# EAGLE design Flight Controller (EAGLE 9.6.2)
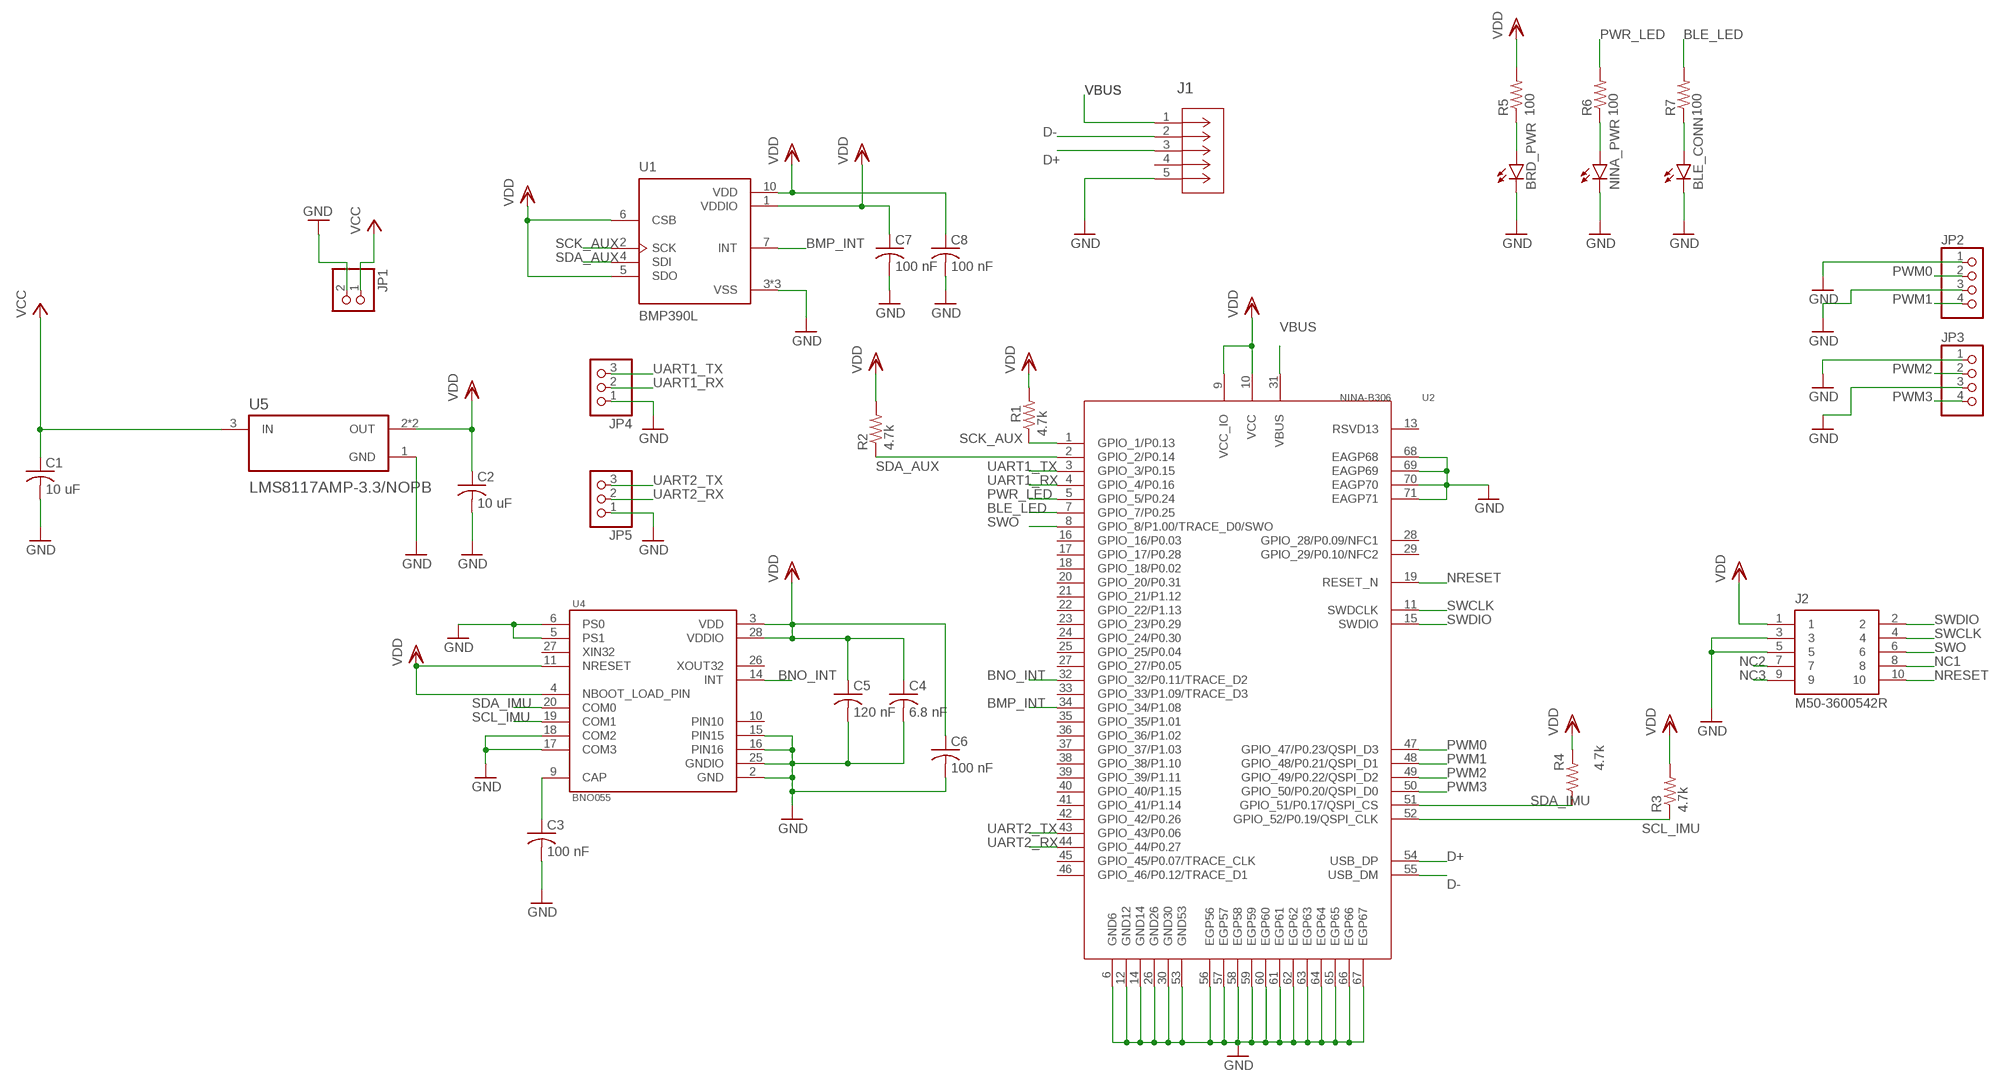
[diagram p0: schematic, sheet 1]

## Parts
BLE_CONN  LEDCHIPLED_1206  [CHIPLED_1206]
BRD_PWR  LEDCHIPLED_1206  [CHIPLED_1206]
C1  10 uF  C-USC1206  [C1206]
C2  10 uF  C-USC1206  [C1206]
C3  100 nF  C-USC1206  [C1206]
C4  6.8 nF  C-USC1206  [C1206]
C5  120 nF  C-USC1206  [C1206]
C6  100 nF  C-USC1206  [C1206]
C7  100 nF  C-USC1206  [C1206]
C8  100 nF  C-USC1206  [C1206]
J1  ZX62-AB-5PA(31)  [CONN5_ZX62-AB-5PA_HIR]
J2  M50-3600542R  [HARWIN_M50-3600542R]
JP1  PINHD-1X2  [1X02]
JP2  PINHD-1X4  [1X04]
JP3  PINHD-1X4  [1X04]
JP4  PINHD-1X3  [1X03]
JP5  PINHD-1X3  [1X03]
NINA_PWR  LEDCHIPLED_1206  [CHIPLED_1206]
R1  4.7k  R-US_R1206  [R1206]
R2  4.7k  R-US_R1206  [R1206]
R3  4.7k  R-US_R1206  [R1206]
R4  4.7k  R-US_R1206  [R1206]
R5  100  R-US_R1206  [R1206]
R6  100  R-US_R1206  [R1206]
R7  100  R-US_R1206  [R1206]
U1  BMP390L  [XDCR_BMP390L]
U2  NINA-B306  NINA-B306NINA-B306_NINA_LGA71R_1500X1000X223_PCB  [NINA_LGA71R_1500X1000X223_PCB]
U4  BNO055  [LGA28R50P4X10_380X520X100]
U5  LMS8117AMP-3.3/NOPB  [SOT230P700X180-4N]

## Nets
BLE_LED: R7.2 U2.7(GPIO_7/P0.25)
BMP_INT: U1.7(INT) U2.34(GPIO_34/P1.08)
BNO_INT: U2.32(GPIO_32/P0.11/TRACE_D2) U4.14(INT)
D+: J1.3(D+) U2.54(USB_DP)
D-: J1.2(D-) U2.55(USB_DM)
GND: BLE_CONN.C BRD_PWR.C C1.2 C2.2 C3.2 C4.2 C5.2 C6.2 C7.2 C8.2 J1.5(GND) J2.3 J2.5 JP1.2 JP2.1 JP2.3 JP3.1 JP3.3 JP4.1 JP5.1 NINA_PWR.C U1.3(VSS) U1.8(VSS) U1.9(VSS) U2.6(GND6) U2.12(GND12) U2.14(GND14) U2.26(GND26) U2.30(GND30) U2.53(GND53) U2.56(EGP56) U2.57(EGP57) U2.58(EGP58) U2.59(EGP59) U2.60(EGP60) U2.61(EGP61) U2.62(EGP62) U2.63(EGP63) U2.64(EGP64) U2.65(EGP65) U2.66(EGP66) U2.67(EGP67) U2.68(EAGP68) U2.69(EAGP69) U2.70(EAGP70) U2.71(EAGP71) U4.2(GND) U4.5(PS1) U4.6(PS0) U4.15(PIN15) U4.16(PIN16) U4.17(COM3) U4.18(COM2) U4.25(GNDIO) U5.1(GND)
N$1: BRD_PWR.A R5.1
N$2: NINA_PWR.A R6.1
N$3: BLE_CONN.A R7.1
N$4: C3.1 U4.9(CAP)
NC1: J2.8
NC2: J2.7
NC3: J2.9
NRESET: J2.10 U2.19(RESET_N)
PWM0: JP2.2 U2.47(GPIO_47/P0.23/QSPI_D3)
PWM1: JP2.4 U2.48(GPIO_48/P0.21/QSPI_D1)
PWM2: JP3.2 U2.49(GPIO_49/P0.22/QSPI_D2)
PWM3: JP3.4 U2.50(GPIO_50/P0.20/QSPI_D0)
PWR_LED: R6.2 U2.5(GPIO_5/P0.24)
SCK_AUX: R1.1 U1.2(SCK) U2.1(GPIO_1/P0.13)
SCL_IMU: R3.1 U2.52(GPIO_52/P0.19/QSPI_CLK) U4.19(COM1)
SDA_AUX: R2.1 U1.4(SDI) U2.2(GPIO_2/P0.14)
SDA_IMU: R4.1 U2.51(GPIO_51/P0.17/QSPI_CS) U4.20(COM0)
SWCLK: J2.4 U2.11(SWDCLK)
SWDIO: J2.2 U2.15(SWDIO)
SWO: J2.6 U2.8(GPIO_8/P1.00/TRACE_D0/SWO)
UART1_RX: JP4.2 U2.4(GPIO_4/P0.16)
UART1_TX: JP4.3 U2.3(GPIO_3/P0.15)
UART2_RX: JP5.2 U2.44(GPIO_44/P0.27)
UART2_TX: JP5.3 U2.43(GPIO_43/P0.06)
VBUS: J1.1(VCC) U2.31(VBUS)
VCC: C1.1 JP1.1 U5.3(IN)
VDD: C2.1 C4.1 C5.1 C6.1 C7.1 C8.1 J2.1 R1.2 R2.2 R3.2 R4.2 R5.2 U1.1(VDDIO) U1.5(SDO) U1.6(CSB) U1.10(VDD) U2.9(VCC_IO) U2.10(VCC) U4.3(VDD) U4.4(NBOOT_LOAD_PIN) U4.11(NRESET) U4.28(VDDIO) U5.2(OUT) U5.4(OUT)
Unconnected: J1.4(ID) U2.13(RSVD13) U2.16(GPIO_16/P0.03) U2.17(GPIO_17/P0.28) U2.18(GPIO_18/P0.02) U2.20(GPIO_20/P0.31) U2.21(GPIO_21/P1.12) U2.22(GPIO_22/P1.13) U2.23(GPIO_23/P0.29) U2.24(GPIO_24/P0.30) U2.25(GPIO_25/P0.04) U2.27(GPIO_27/P0.05) U2.28(GPIO_28/P0.09/NFC1) U2.29(GPIO_29/P0.10/NFC2) U2.33(GPIO_33/P1.09/TRACE_D3) U2.35(GPIO_35/P1.01) U2.36(GPIO_36/P1.02) U2.37(GPIO_37/P1.03) U2.38(GPIO_38/P1.10) U2.39(GPIO_39/P1.11) U2.40(GPIO_40/P1.15) U2.41(GPIO_41/P1.14) U2.42(GPIO_42/P0.26) U2.45(GPIO_45/P0.07/TRACE_CLK) U2.46(GPIO_46/P0.12/TRACE_D1) U4.26(XOUT32) U4.27(XIN32)

## Power pins joined to a net without a drawn wire
PIN10: U4.10(PIN10)

## Library data of the parts
BLE_CONN BRD_PWR NINA_PWR = led:LED: LED OSRAM: - CHIPLED LG R971, LG N971, LY N971, LG Q971, LY Q971, LO R971, LY R971 LH N974, LH R974 LS Q976, LO Q976, LY Q976 LO Q996 - Hyper CHIPLED LW Q18S LB Q993, LB Q99A, LB R99A - SideLED LS A670, LO A670, LY A670, LG A670, LP A670 LB A673, LV A673, LT A673, LW A673 LH A674 LY A675 LS A676, LA A676, LO A676, LY A676, LW A676 LS A679, LY A679, LG A679 - Hyper Micro SIDELED® LS Y876, LA Y876, LO Y876, LY Y876 LT Y87S - SmartLED LW L88C, LW L88S LB L89C, LB L89S, LG L890 LS L89K, LO L89K, LY L89K LS L896, LA L896, LO L896, LY L896 - TOPLED LS T670, LO T670, LY T670, LG T670, LP T670 LSG T670, LSP T670, LSY T670, LOP T670, LYG T670 LG T671, LOG T671, LSG T671 LB T673, LV T673, LT T673, LW T673 LH T674 LS T676, LA T676, LO T676, LY T676, LB T676, LH T676, LSB T676, LW T676 LB T67C, LV T67C, LT T67C, LS T67K, LO T67K, LY T67K, LW E67C LS E67B, LA E67B, LO E67B, LY E67B, LB E67C, LV E67C, LT E67C LW T67C LS T679, LY T679, LG T679 LS T770, LO T770, LY T770, LG T770, LP T770 LB T773, LV T773, LT T773, LW T773 LH T774 LS E675, LA E675, LY E675, LS T675 LS T776, LA T776, LO T776, LY T776, LB T776 LHGB T686 LT T68C, LB T68C - Hyper Mini TOPLED® LB M676 - Mini TOPLED Santana® LG M470 LS M47K, LO M47K, LY M47K Source: http://www.osram.convergy.de LUXEON: - LUMILED® LXK2-PW12-R00, LXK2-PW12-S00, LXK2-PW14-U00, LXK2-PW14-V00 LXK2-PM12-R00, LXK2-PM12-S00, LXK2-PM14-U00 LXK2-PE12-Q00, LXK2-PE12-R00, LXK2-PE12-S00, LXK2-PE14-T00, LXK2-PE14-U00 LXK2-PB12-K00, LXK2-PB12-L00, LXK2-PB12-M00, LXK2-PB14-N00, LXK2-PB14-P00, LXK2-PB14-Q00 LXK2-PR12-L00, LXK2-PR12-M00, LXK2-PR14-Q00, LXK2-PR14-R00 LXK2-PD12-Q00, LXK2-PD12-R00, LXK2-PD12-S00 LXK2-PH12-R00, LXK2-PH12-S00 LXK2-PL12-P00, LXK2-PL12-Q00, LXK2-PL12-R00 Source: www.luxeon.com KINGBRIGHT: KA-3528ASYC Source: www.kingbright.com
C1-C8 = rcl:C-US: CAPACITOR, American symbol; SPICEPREFIX: C
J1 = USBHousing:ZX62-AB-5PA(31); COPYRIGHT: Copyright (C) 2022 Ultra Librarian. All rights reserved.; DIGI-KEY_PART_NUMBER_1: H125279CT-ND; DIGI-KEY_PART_NUMBER_2: H125279DKR-ND; DIGI-KEY_PART_NUMBER_3: H125279TR-ND; MANUFACTURER_PART_NUMBER: ZX62-AB-5PA(31); MFR_NAME: Hirose
J2 = M50-3600542R:M50-3600542R: Connector Header Surface Mount 10 position 0.050 Inch (1.27mm) Check availability <https://pricing.snapeda.com/parts/M50-3600542R/Harwin%20Inc./view-part?ref=eda>; AVAILABILITY: In Stock; DESCRIPTION: Connector Header Surface Mount 10 position 0.050 (1.27mm); MF: Harwin Inc.; MP: M50-3600542R; PACKAGE: None; PRICE: None; PURCHASE-URL: https://pricing.snapeda.com/search/part/M50-3600542R/?ref=eda
JP1 = pinhead:PINHD-1X2: PIN HEADER
JP2 JP3 = pinhead:PINHD-1X4: PIN HEADER
JP4 JP5 = pinhead:PINHD-1X3: PIN HEADER
R1-R7 = rcl:R-US_: RESISTOR, American symbol; SPICEPREFIX: R
U1 = BMP390L:BMP390L: Check availability <https://pricing.snapeda.com/parts/BMP390L/Bosch%20Sensortec/view-part?ref=eda>; AVAILABILITY: In Stock; DESCRIPTION: Pressure Sensor 4.35PSI ~ 18.13PSI (30kPa ~ 125kPa) Absolute - - 10-WFLGA; MF: Bosch Sensortec; MP: BMP390L; PACKAGE: None; PRICE: None; PURCHASE-URL: https://pricing.snapeda.com/search/part/BMP390L/?ref=eda
U2 = ubloxLib:NINA-B306: u-blox NINA-B306 Bluetooth 5 LE, 802.15.4 module; MANUFACTURER: u-blox; PART_DESCRIPTION: Stand-alone Bluetooth low energy module
U4 = BNO055:BNO055: BNO055 9-axis Absolute Orientation Sensor ( SiP ) w/Sensors and Sensor Fusion Check availability <https://pricing.snapeda.com/parts/BNO055/Bosch/view-part?ref=eda>; AVAILABILITY: In Stock; DESCRIPTION: BNO055 series Accelerometer, Gyroscope, Magnetometer, 3 Axis Sensor Evaluation Board; MF: Bosch; MP: BNO055; PACKAGE: LGA-28 Bosch; PRICE: None; PURCHASE-URL: https://pricing.snapeda.com/search/part/BNO055/?ref=eda
U5 = LMS8117AMP-3.3_NOPB:LMS8117AMP-3.3/NOPB: Check availability <https://pricing.snapeda.com/parts/LMS8117AMP-3.3/NOPB/Texas%20Instruments/view-part?ref=eda>; AVAILABILITY: In Stock; DESCRIPTION: 1-A, 15-V, linear voltage regulator from 0°C to 125°C; MF: Texas Instruments; MP: LMS8117AMP-3.3/NOPB; PACKAGE: SOT-223-4 Texas Instruments; PRICE: None; PURCHASE-URL: https://pricing.snapeda.com/search/part/LMS8117AMP-3.3/NOPB/?ref=eda

## Board
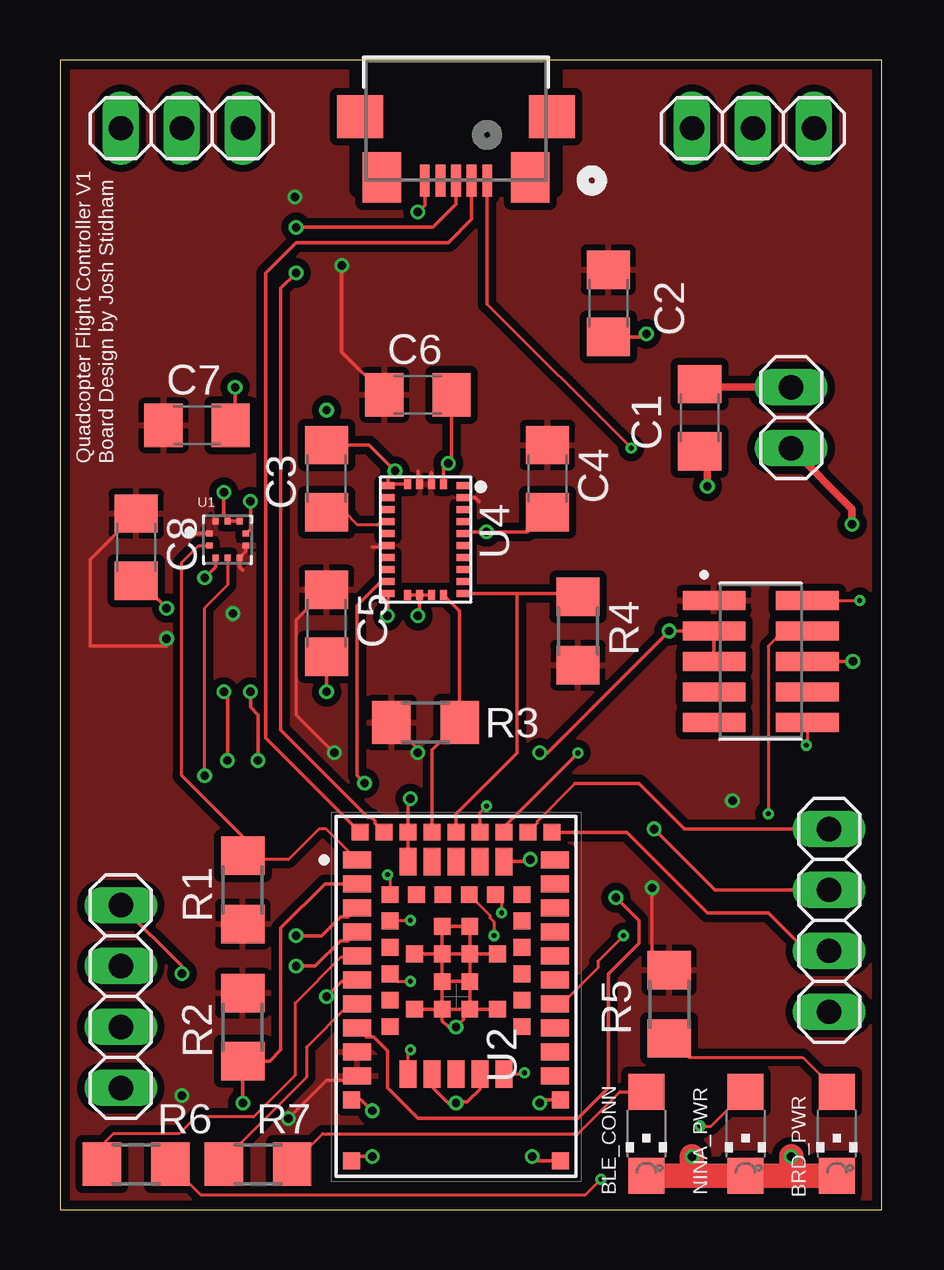
[diagram p1: board, top side]
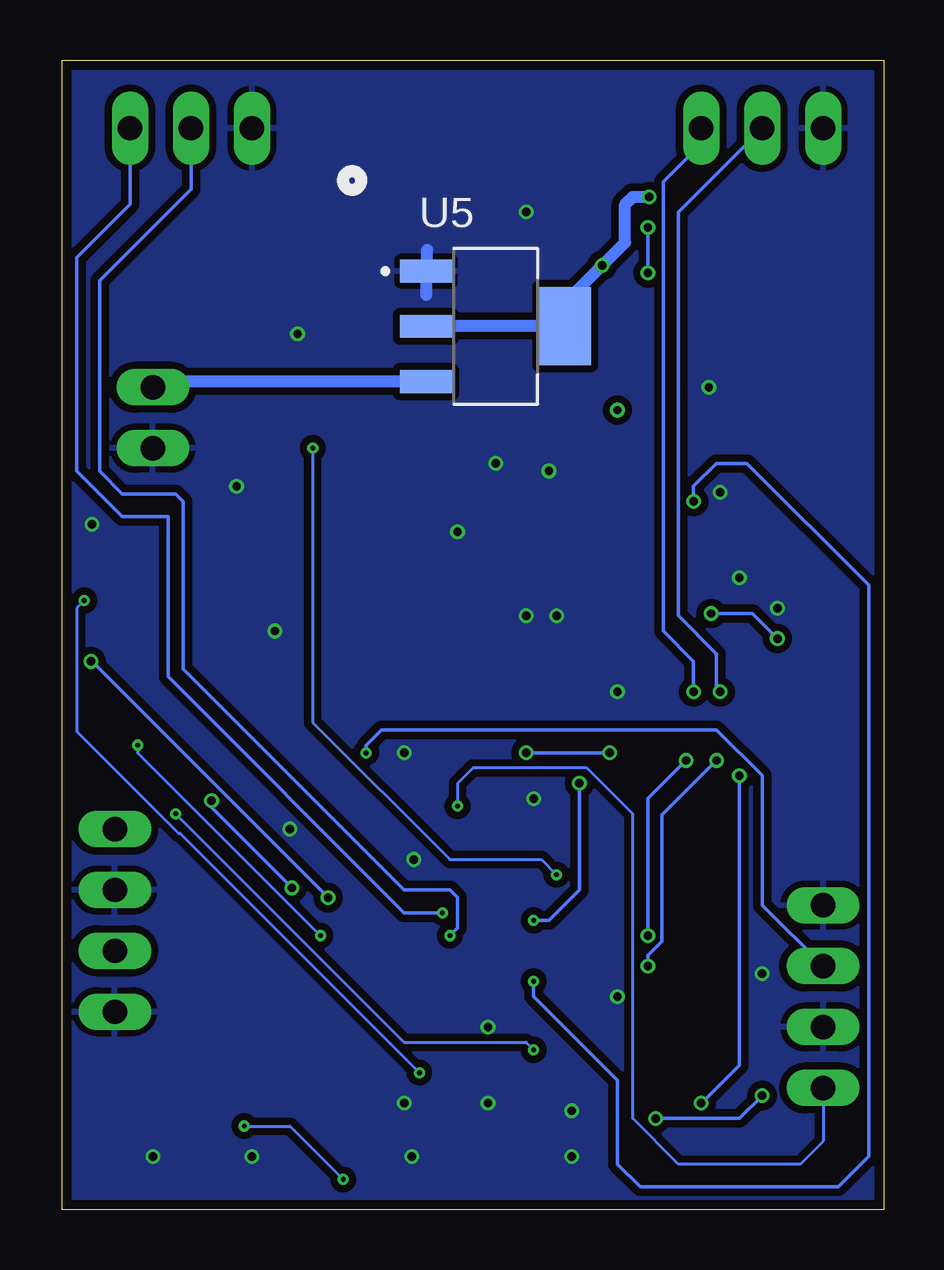
[diagram p2: board, bottom side, seen from below]

Size 34.27 x 47.93 mm. Coordinates in mm from the lower left corner, seen from the top.
Outline: 0,0 34.27,0 34.27,47.93 0,47.93 0,0
Copper layers (1*16): Top 0.035mm / dielectric 1.5mm / Bottom 0.035mm
Design rules "default *": minimum track width 5mil, minimum drill 0.2mm, track to track 5mil, track to pad 0.2mm, pad to pad 5mil, via to via 0.5mm, smd to smd 5mil, copper to edge 0.4mm, drill to drill 0.5mm, minimum pad ring 0.13mm, minimum via ring 0.13mm, stop-mask expansion 4mil, vias tented up to drill 0mil, thermal gap 10mil

### Footprints (pad centres in the part's own frame; a part is rotated, then mirrored left to right if it is on the bottom)
CHIPLED_1206 = smd 1.5 x 1.5: A 0,-1.75; C 0,1.75
C1206 = smd 1.6 x 1.8: 1 -1.4,0; 2 1.4,0
CONN5_ZX62-AB-5PA_HIR = smd 0.406 x 1.346: 1 -1.3,2.502; 2 -0.65,2.502; 3 0,2.502; 4 0.65,2.502; 5 1.3,2.502 | smd 1.6 x 2.108: 6 -3.099,2.375; 7 3.099,2.375 | smd 1.905 x 1.803: 8 -4,-0.165; 9 4,-0.165
HARWIN_M50-3600542R = smd 0.8 x 2.62: 1 -2.54,-1.94; 2 -2.54,1.94; 3 -1.27,-1.94; 4 -1.27,1.94; 5 0,-1.94; 6 0,1.94; 7 1.27,-1.94; 8 1.27,1.94; 9 2.54,-1.94; 10 2.54,1.94
1X02 = drill 1.016 long: 1 -1.27,0; 2 1.27,0
1X04 = drill 1.016 long: 1 -3.81,0; 2 -1.27,0; 3 1.27,0; 4 3.81,0
1X03 = drill 1.016 long: 1 -2.54,0; 2 0,0; 3 2.54,0
R1206 = smd 1.6 x 1.803: 1 -1.422,0; 2 1.422,0
XDCR_BMP390L = smd 0.275 x 0.25: 1 -0.762,0.25; 2 -0.762,-0.25; 6 0.762,-0.25; 7 0.762,0.25 | smd 0.25 x 0.275: 3 -0.5,-0.762; 4 0,-0.762; 5 0.5,-0.762; 8 0.5,0.762; 9 0,0.762; 10 -0.5,0.762
NINA_LGA71R_1500X1000X223_PCB = smd 0.7 x 1.15: 1 -5.7,-4.125; 2 -4.7,-4.125; 3 -3.7,-4.125; 4 -2.7,-4.125; 5 -1.7,-4.125; 6 -0.7,-4.125; 7 0.3,-4.125; 8 1.3,-4.125; 9 2.3,-4.125; 10 3.3,-4.125; 16 3.3,4.125; 17 2.3,4.125; 18 1.3,4.125; 19 0.3,4.125; 20 -0.7,4.125; 21 -1.7,4.125; 22 -2.7,4.125; 23 -3.7,4.125; 24 -4.7,4.125; 25 -5.7,4.125 | smd 1.15 x 0.7: 11 3.225,-2; 12 3.225,-1; 13 3.225,0; 14 3.225,1; 15 3.225,2; 26 -5.625,2; 27 -5.625,1; 28 -5.625,0; 29 -5.625,-1; 30 -5.625,-2 | smd 0.7 x 0.7: 31 -4.25,-2.75; 32 -3.15,-2.75; 33 -2.05,-2.75; 34 -0.95,-2.75; 35 0.15,-2.75; 36 1.25,-2.75; 37 1.25,2.75; 38 0.15,2.75; 39 -0.95,2.75; 40 -2.05,2.75; 41 -3.15,2.75; 42 -4.25,2.75; 43 -4.25,1.65; 44 -4.25,0.55; 45 -4.25,-0.55; 46 -4.25,-1.65; 47 -6.85,4; 48 -6.85,3; 49 -6.85,2; 50 -6.85,1; 51 -6.85,0; 52 -6.85,-1; 53 -6.85,-2; 54 -6.85,-3; 55 -6.85,-4; 56 -2.925,-0.575; 57 -2.925,0.575; 58 -1.775,-1.725; 59 -1.775,-0.575; 60 -1.775,0.575; 61 -1.775,1.725; 62 -0.625,-0.575; 63 -0.625,0.575; 64 0.525,-1.725; 65 0.525,-0.575; 66 0.525,0.575; 67 0.525,1.725; 68 4.3,-4.35; 69 6.85,-4.35; 70 6.85,4.35; 71 4.3,4.35
LGA28R50P4X10_380X520X100 = smd 0.3 x 0.525: 1 -2.25,1.562; 6 -2.25,-1.562; 7 -1.75,-1.562; 8 -1.25,-1.562; 9 -0.75,-1.562; 10 -0.25,-1.562; 11 0.25,-1.562; 12 0.75,-1.562; 13 1.25,-1.562; 14 1.75,-1.562; 15 2.25,-1.562; 20 2.25,1.562; 21 1.75,1.562; 22 1.25,1.562; 23 0.75,1.562; 24 0.25,1.562; 25 -0.25,1.562; 26 -0.75,1.562; 27 -1.25,1.562; 28 -1.75,1.562 | smd 0.425 x 0.3: 2 -2.312,0.75; 3 -2.312,0.25; 4 -2.312,-0.25; 5 -2.312,-0.75; 16 2.312,-0.75; 17 2.312,-0.25; 18 2.312,0.25; 19 2.312,0.75
SOT230P700X180-4N = smd 2.15 x 0.95: 1 -2.9,2.3; 2 -2.9,0; 3 -2.9,-2.3 | smd 2.15 x 3.25: 4 2.9,0

### Placement (x,y rotation side)
BLE_CONN  24.45,3.17 180 top
BRD_PWR  32.38,3.17 180 top
C1  26.67,33.02 270 top
C2  22.86,37.78 270 top
C3  11.11,30.48 90 top
C4  20.32,30.48 270 top
C5  11.11,24.45 270 top
C6  14.92,33.97 0 top
C7  5.71,32.7 0 top
C8  3.17,27.62 270 top
J1  16.51,45.4 180 top
J2  29.21,22.86 270 top
JP1  30.48,33.02 270 top
JP2  32.07,12.06 90 top
JP3  2.54,8.89 270 top
JP4  5.08,45.09 0 top
JP5  28.89,45.09 0 top
NINA_PWR  28.57,3.17 180 top
R1  7.62,13.34 270 top
R2  7.62,7.62 90 top
R3  15.24,20.32 180 top
R4  21.59,24.13 270 top
R5  25.4,8.57 90 top
R6  3.17,1.91 180 top
R7  8.26,1.91 180 top
U1  6.99,27.94 0 top
U2  16.51,8.89 270 top
U4  15.24,27.94 270 top
U5  16.19,36.83 0 bottom

### Tracks (layer width: path | path; a pad name or v marks a point on that pad's centre or on a via)
BLE_LED
  Top 0.127: U2.7 12.32,8.52 12.02,8.52 10.28,6.78 10.28,5.51 6.83,2.07 R7.2
BMP_INT  (via drill 0.2, 0.35)
  Top 0.127: U2.34 14.07,9.53 v14.61,9.53
  Top 0.152: v7.94,29.53 7.94,28.38 U1.7
  Bottom 0.152: v14.61,9.53 14.61,8.89 11.11,5.4 11.11,1.91 10.16,0.95 1.91,0.95 0.64,2.22 0.64,26.04 5.71,31.11 6.99,31.11 7.94,30.16 v7.94,29.53
BNO_INT  (via drill 0.2, 0.35)
  Top 0.127: v14.61,12.06 14.58,12.04 U2.32
  Top 0.152: U4.14 13.6,26.12 13.3,26.12 12.38,25.2 12.38,18.1 v12.7,17.78
  Bottom 0.152: v12.7,17.78 12.7,13.34 13.97,12.06 v14.61,12.06
D+  (via drill 0.35)
  Top 0.152: v9.84,40.96 15.56,40.96 16.51,41.91 J1.3 | U2.54 13.14,16.11 13.14,16.2 12.97,16.37 12.84,16.37 9.21,20 9.21,38.42 v9.84,39.05
  Bottom 0.152: v9.84,40.96 v9.84,39.05
D-
  Top 0.152: U2.55 8.57,19.68 8.57,39.05 9.84,40.32 16.19,40.32 17.16,41.29 J1.2
GND  (via drill 0.35)
  Top 0.152: v7.3,34.29 7.3,32.89 C7.2 | v11.11,21.59 C5.2 | v24.45,36.51 24.32,36.38 C2.2 | C1.2 26.99,31.3 | J2.5 J2.3 v25.4,24.13 20.32,19.05 v20,19.05 | U4.15 13.68,24.79 v13.65,24.77 | U4.17 14.99,24.83 v14.92,24.77 | U4.25 16.87,28.26 v17.78,28.26 19.5,28.26 C4.2 | U4.16 U4.17 | U4.18 U4.17 | U4.5 13.74,30.25 U4.6 13.68,30.5 v13.97,30.8 12.89,31.88 C3.2 | U4.2 15.99,30.91 v16.19,31.11 16.32,31.25 C6.2 | U1.8 U1.9 7.06,28.78 6.83,29.01 v6.83,29.9 | U1.3 6.49,26.8 v6.03,26.35 | C8.2 3.31,26.22 v4.45,25.08 | v14.61,17.14 14.51,17.05 U2.53 U2.30 | U2.26 19.51,14.52 v19.6,14.61 | U2.64 15.88,8.37 | 15.88,8.37 U2.65 | U2.67 U2.66 | U2.58 U2.59 | U2.61 U2.60 | U2.59 U2.56 U2.57 U2.60 | U2.59 U2.60 | U2.62 16.83,9.52 | 16.83,9.52 U2.63 U2.66 | U2.59 U2.62 | U2.60 17.09,9.77 16.83,9.52 | U2.65 16.83,8.37 | 16.83,8.37 U2.66 | U2.62 15.94,8.43 15.88,8.37 | U2.65 15.94,7.88 16.19,7.62 v16.51,7.62 16.83,7.94 16.83,8.37 | JP3.1 5.08,10.16 v5.08,9.84 | U2.6 12.33,9.53 12.01,9.53 12,9.53 11.75,9.53 v11.11,8.89 | U2.68 12.55,4.59 v13.02,4.13 | U2.69 12.34,2.22 v13.02,2.22 | U2.70 19.87,2.04 v19.68,2.22 | U2.71 20.15,4.59 v20,4.45 | U2.12 15.57,5.61 15.57,5.07 16.19,4.45 v16.51,4.45 16.56,4.5 16.97,4.5 17.51,5.03 U2.14 | J1.5 15.21,41.88 v14.92,41.59 | JP2.3 27.3,13.34 v24.77,15.88
  Top 0.305: 26.99,31.3 v26.99,30.16 | JP1.2 33.02,29.21 v33.02,28.57
  Top 1.016: BLE_CONN.C 26.67,1.43 | 26.67,1.43 NINA_PWR.C 30.48,1.43 | 30.48,1.43 BRD_PWR.C | 26.67,1.43 26.35,1.74 v26.35,2.22 | 30.48,1.43 v30.48,2.22
  Bottom 0.305: 19.09,38.14 19.05,38.1 | U5.1 19.05,39.17
  Bottom 0.508: U5.1 19.09,38.14 | 19.05,39.17 19.05,40.01
  pour Bottom (isolate 0.305): 0,47.94 0,0 34.29,0 34.29,47.94
N$1
  Top 0.127: R5.1 26.2,6.35 30.96,6.35 BRD_PWR.A
N$2  (via drill 0.2)
  Top 0.127: R6.1 5.87,0.64 21.91,0.64 v22.54,1.27 | v26.67,3.49 27.14,3.49 NINA_PWR.A
  Bottom 0.127: v22.54,1.27 24.77,3.49 v26.67,3.49
N$3
  Top 0.127: R7.1 10.95,3.17 21.59,3.17 23.34,4.92 BLE_CONN.A
N$4
  Top 0.127: C3.1 11.88,29.08 12.38,28.57 13.28,28.57 13.31,28.6 13.59,28.6 U4.9
N$6  (via drill 0.35)
  other vias: 11.11,33.34
NRESET  (via drill 0.2)
  Top 0.127: J2.10 31.15,19.4 v31.11,19.37 | v23.5,11.43 22.43,10.36 22.43,10.08 20.93,8.59 U2.19
  Bottom 0.127: v31.11,19.37 31.11,19.05 v23.5,11.43
PWM0
  Top 0.152: U2.47 23.63,15.74 26.99,12.38 29.53,12.38 31.11,10.79 JP2.2
PWM1
  Top 0.127: U2.48 19.9,16.13 19.9,16.2 21.48,17.78
  Top 0.152: JP2.4 26.04,15.88 24.13,17.78 21.48,17.78
PWM2  (via drill 0.2)
  Top 0.152: U2.49 18.51,15.97 v21.59,19.05
  Bottom 0.152: JP3.2 5.08,12.7 5.08,18.1 6.99,20 20.95,20 21.59,19.37 v21.59,19.05
PWM3  (via drill 0.2)
  Top 0.127: 17.51,16.24 17.51,16.56 v17.78,16.83
  Top 0.152: U2.50 17.51,16.24
  Bottom 0.127: JP3.4 2.54,2.86 3.49,1.91 8.57,1.91 10.48,3.81 10.48,16.51 12.38,18.41 17.14,18.41 17.78,17.78 v17.78,16.83
PWR_LED
  Top 0.127: U2.5 12.07,10.59 12,10.52 11.7,10.52 9.79,8.61 9.79,5.61 8.06,3.88 5.67,3.88 4.97,3.17 2.22,3.17 1.75,2.71 R6.2
SCK_AUX
  Top 0.127: U2.1 11.1,15.88 10.79,15.88 9.53,14.61 7.62,14.61 | 5.08,18.1 5.08,26.99 5.78,27.69 U1.2
  Top 0.152: 7.62,14.61 R1.1 7.62,15.56 5.08,18.1
SCL_IMU
  Top 0.152: U2.52 15.51,19.17 R3.1 16.66,24.96 U4.19
SDA_AUX  (via drill 0.35)
  Top 0.127: v6.03,18.1 6.03,25.08 6.99,26.04 U1.4
  Top 0.152: U2.2 11.05,13.59 9.21,11.75 9.21,6.67 8.74,6.2 R2.1 v7.62,4.45
  Bottom 0.152: v6.03,18.1 6.03,6.03 v7.62,4.45
SDA_IMU
  Top 0.152: U4.20 19.05,25.69 | 19.05,25.69 21.45,25.69 R4.1 | U2.51 16.51,16.51 19.05,19.05 19.05,25.69
SWCLK  (via drill 0.2)
  Top 0.127: U2.11 14.51,6.57 v14.61,6.67 | J2.4 30.83,23.81 29.84,23.81 29.53,23.5 v29.53,16.51
  Bottom 0.127: v29.53,16.51 20,6.99 14.92,6.99 v14.61,6.67
SWDIO  (via drill 0.2)
  Top 0.127: U2.15 19.32,5.67 v19.37,5.71 | J2.2 v33.34,25.4
  Bottom 0.127: v19.37,5.71 29.35,15.7 29.41,15.7 33.66,19.94 33.66,25.08 v33.34,25.4
SWO  (via drill 0.35)
  Top 0.152: U2.8 12.76,7.22 13.07,7.22 13.65,6.64 13.65,5.08 14.92,3.81 21.59,3.81 22.86,5.08 22.86,9.84 24.13,11.11 24.13,12.06 v23.18,13.02 | v33.05,22.86 J2.6
  Bottom 0.152: v33.05,22.86 33.02,22.86 v23.18,13.02
UART1_RX  (via drill 0.35)
  Top 0.152: U2.4 12.01,11.22 11.7,11.22 10.64,10.16 v9.84,10.16 | v6.99,18.73 6.99,21.43 v6.83,21.59
  Bottom 0.152: v9.84,10.16 9.84,10.61 9.26,11.19 9.26,16.46 v6.99,18.73 | v6.83,21.59 6.99,21.75 6.99,23.18 8.57,24.77 8.57,41.59 JP4.2
UART1_TX  (via drill 0.35)
  Top 0.152: U2.3 12.01,12.22 11.7,12.22 10.91,11.43 v9.84,11.43 | v8.26,18.73 8.26,20.64 7.94,20.95 v7.94,21.59
  Bottom 0.152: v9.84,11.43 9.84,17.14 v8.26,18.73 | v7.94,21.59 7.94,22.86 9.21,24.13 9.21,42.86 7.62,44.45 JP4.3
UART2_RX  (via drill 0.2)
  Top 0.127: U2.44 17.92,12.28 17.92,12.18 18.1,12 v18.1,11.43
  Bottom 0.152: v18.1,11.43 17.78,11.75 17.78,13.02 18.1,13.34 20,13.34 29.21,22.54 29.21,29.53 29.53,29.84 31.75,29.84 32.7,30.8 32.7,38.73 28.89,42.55 JP5.2
UART2_TX  (via drill 0.2)
  Top 0.127: U2.43 18.41,12.88 v18.41,12.38
  Bottom 0.152: v18.41,12.38 20,12.38 29.84,22.23 29.84,28.89 31.75,28.89 33.66,30.8 33.66,39.69 31.43,41.91 JP5.3
VBUS  (via drill 0.2)
  Top 0.127: v13.65,13.97 13.76,13.86 U2.31 | 17.81,37.75 v23.81,31.75
  Top 0.152: J1.1 17.81,37.75
  Bottom 0.127: v23.81,31.75 23.81,20.32 18.1,14.61 14.29,14.61 v13.65,13.97
VCC
  Top 0.152: 26.8,34.29 C1.1
  Top 0.305: JP1.1 26.8,34.29
  Bottom 0.508: U5.3 30.24,34.53 JP1.1
VDD  (via drill 0.35)
  Top 0.152: U4.11 13.61,27.62 13.02,27.62 | U4.4 14.92,30.32 14.92,30.8 | U4.3 15.49,30.73 | U4.28 17.3,29.69 17.46,29.53 | U1.1 5.46,28.19 5.4,28.26 | U1.6 7.75,27.44 U1.5 7.49,26.8 7.62,26.67 | C5.1 9.84,24.58 9.84,20.64 v11.43,19.05 | R3.2 14.92,19.21 v14.92,19.05 | C6.1 11.75,35.75 v11.75,39.37 | C8.1 1.27,27.12 1.27,23.5 4.45,23.5 v4.45,23.81 | U2.10 12.19,5.4 11.11,5.4 v9.53,3.81 | R5.2 24.68,10.71 v24.68,13.42
  Bottom 0.152: v11.43,19.05 v14.92,19.05 | v4.45,23.81 5.49,24.86 v7.21,24.86 | v9.53,3.81 6.03,3.81 v5.08,4.76 | v24.68,13.42 28.03,16.77 v28.03,17.05 | 13.29,37.83 U5.4
  Bottom 0.508: v9.79,42.23 10.48,42.23 10.79,41.91 10.79,40.32 v11.75,39.37 13.29,37.83 | U5.4 U5.2
  pour Top (isolate 0.305): 0,47.94 0,0 34.29,0 34.29,47.94

### Text on the board
tNames: Quadcopter Flight Controller V1 | Board Design by Josh Stidham